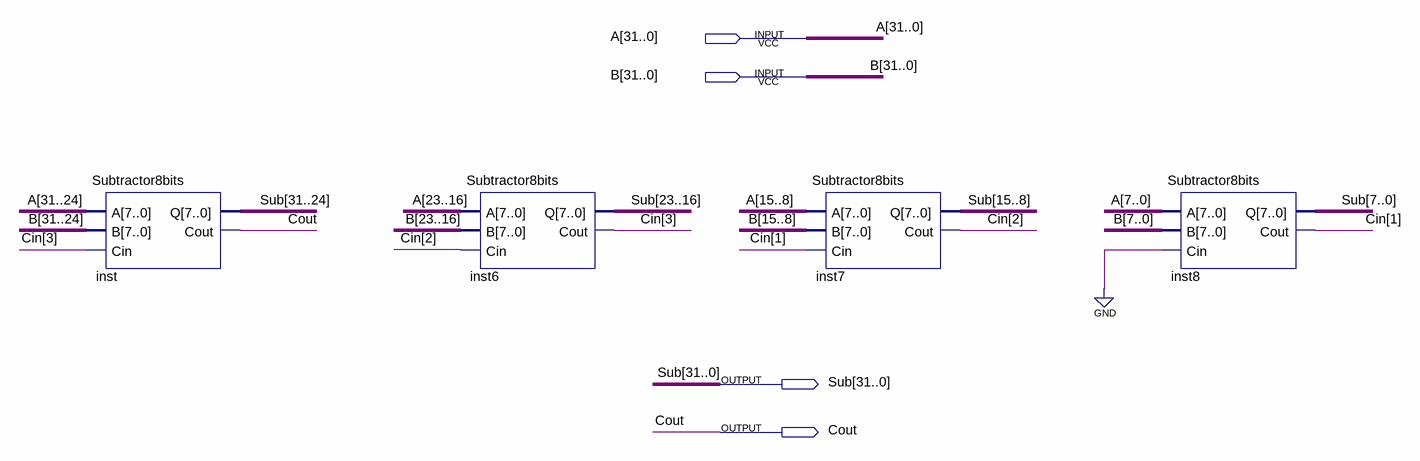
[diagram p0: schematic sheet]
// Quartus schematic Subtractor32bits.bdf as structural Verilog: 4 symbols, 4 pins
module Subtractor32bits (
  input  [31:0] A,
  input  [31:0] B,
  output [31:0] Sub,
  output Cout
);

  wire [3:1] Cin;

  Subtractor8bits inst (.A(A[31:24]), .B(B[31:24]), .Cin(Cin[3]), .Q(Sub[31:24]), .Cout(Cout));
  Subtractor8bits inst6 (.A(A[23:16]), .B(B[23:16]), .Cin(Cin[2]), .Q(Sub[23:16]), .Cout(Cin[3]));
  Subtractor8bits inst7 (.A(A[15:8]), .B(B[15:8]), .Cin(Cin[1]), .Q(Sub[15:8]), .Cout(Cin[2]));
  Subtractor8bits inst8 (.A(A[7:0]), .B(B[7:0]), .Cin(1'b0), .Q(Sub[7:0]), .Cout(Cin[1]));
endmodule
